# Altium schematic sheet FPGAtop.SchDoc
size A4
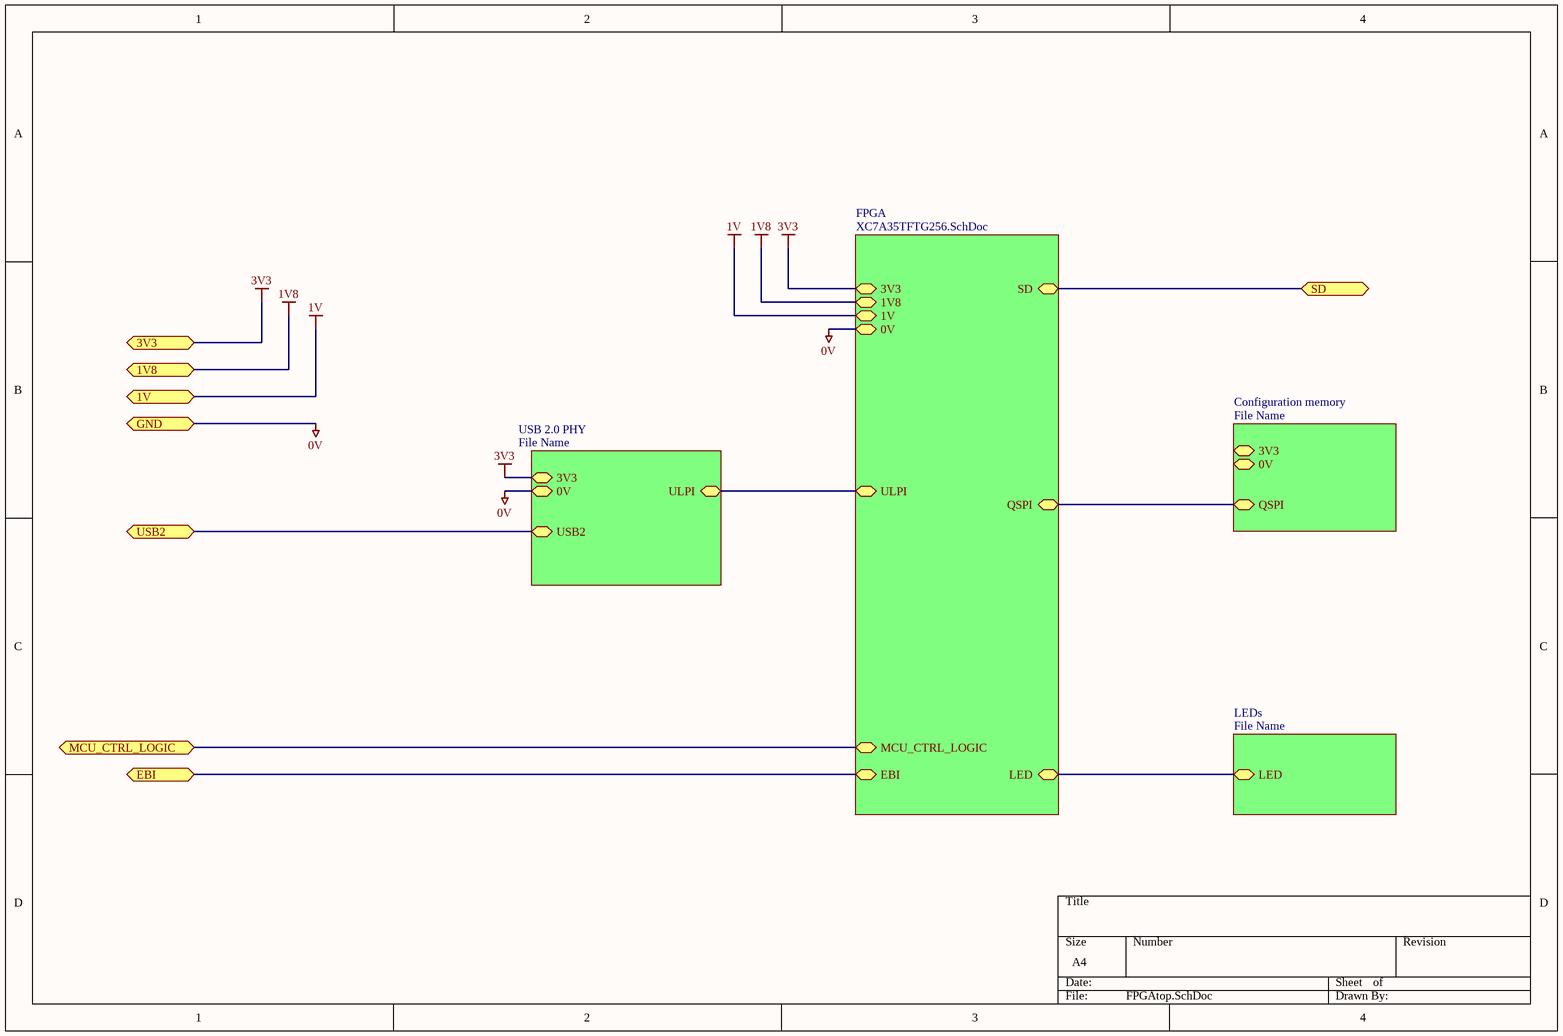
[diagram p0: FPGAtop.SchDoc]

## Sub-sheets
Configuration memory = File Name: QSPI, 3V3, 0V
FPGA = XC7A35TFTG256.SchDoc: SD, 3V3, 1V8, 1V, 0V, QSPI, ULPI, EBI, LED, MCU_CTRL_LOGIC
LEDs = File Name: LED
USB 2.0 PHY = File Name: ULPI, USB2, 3V3, 0V

## Ports
1V, 1V8, 3V3, EBI, GND, MCU_CTRL_LOGIC, SD, USB2

## Nets
0V: port GND, sheet FPGA/0V, sheet USB 2.0 PHY/0V
1V: port 1V, sheet FPGA/1V
1V8: port 1V8, sheet FPGA/1V8
3V3: port 3V3, sheet FPGA/3V3, sheet USB 2.0 PHY/3V3
EBI: port EBI, sheet FPGA/EBI
MCU_CTRL_LOGIC: port MCU_CTRL_LOGIC, sheet FPGA/MCU_CTRL_LOGIC
SD: port SD, sheet FPGA/SD
USB2: port USB2, sheet USB 2.0 PHY/USB2
(unnamed): sheet Configuration memory/QSPI, sheet FPGA/QSPI
(unnamed): sheet FPGA/ULPI, sheet USB 2.0 PHY/ULPI
(unnamed): sheet FPGA/LED, sheet LEDs/LED